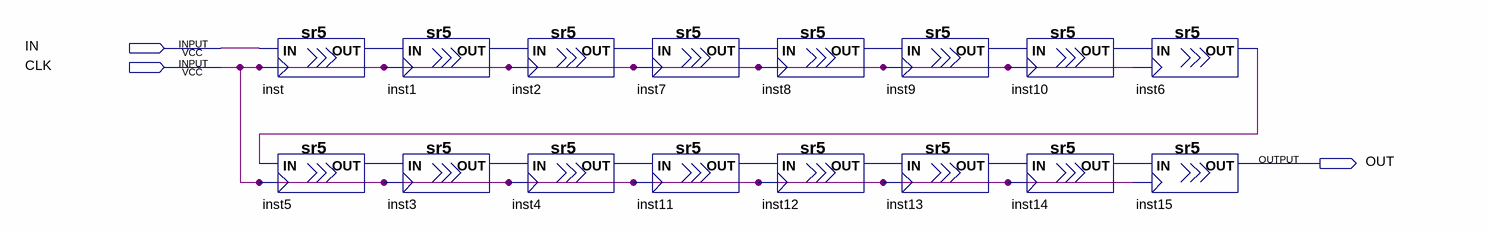
[diagram p0: schematic sheet]
// Quartus schematic sr80.bdf as structural Verilog: 16 symbols, 3 pins
module sr80 (
  input  IN,
  input  CLK,
  output OUT
);

  wire inst1_out, inst2_out, inst3_out, inst4_out, inst5_out, inst6_out, inst7_out, inst8_out, inst9_out,
       inst10_out, inst11_out, inst12_out, inst13_out, inst14_out, inst_out;

  sr5 inst (.IN(IN), .CLK(CLK), .OUT(inst_out));
  sr5 inst5 (.IN(inst6_out), .CLK(CLK), .OUT(inst5_out));
  sr5 inst1 (.IN(inst_out), .CLK(CLK), .OUT(inst1_out));
  sr5 inst3 (.IN(inst5_out), .CLK(CLK), .OUT(inst3_out));
  sr5 inst2 (.IN(inst1_out), .CLK(CLK), .OUT(inst2_out));
  sr5 inst4 (.IN(inst3_out), .CLK(CLK), .OUT(inst4_out));
  sr5 inst7 (.IN(inst2_out), .CLK(CLK), .OUT(inst7_out));
  sr5 inst11 (.IN(inst4_out), .CLK(CLK), .OUT(inst11_out));
  sr5 inst8 (.IN(inst7_out), .CLK(CLK), .OUT(inst8_out));
  sr5 inst12 (.IN(inst11_out), .CLK(CLK), .OUT(inst12_out));
  sr5 inst9 (.IN(inst8_out), .CLK(CLK), .OUT(inst9_out));
  sr5 inst13 (.IN(inst12_out), .CLK(CLK), .OUT(inst13_out));
  sr5 inst10 (.IN(inst9_out), .CLK(CLK), .OUT(inst10_out));
  sr5 inst14 (.IN(inst13_out), .CLK(CLK), .OUT(inst14_out));
  sr5 inst6 (.IN(inst10_out), .CLK(CLK), .OUT(inst6_out));
  sr5 inst15 (.IN(inst14_out), .CLK(CLK), .OUT(OUT));
endmodule
